# EAGLE schematic MSboard (EAGLE 7.2.0)
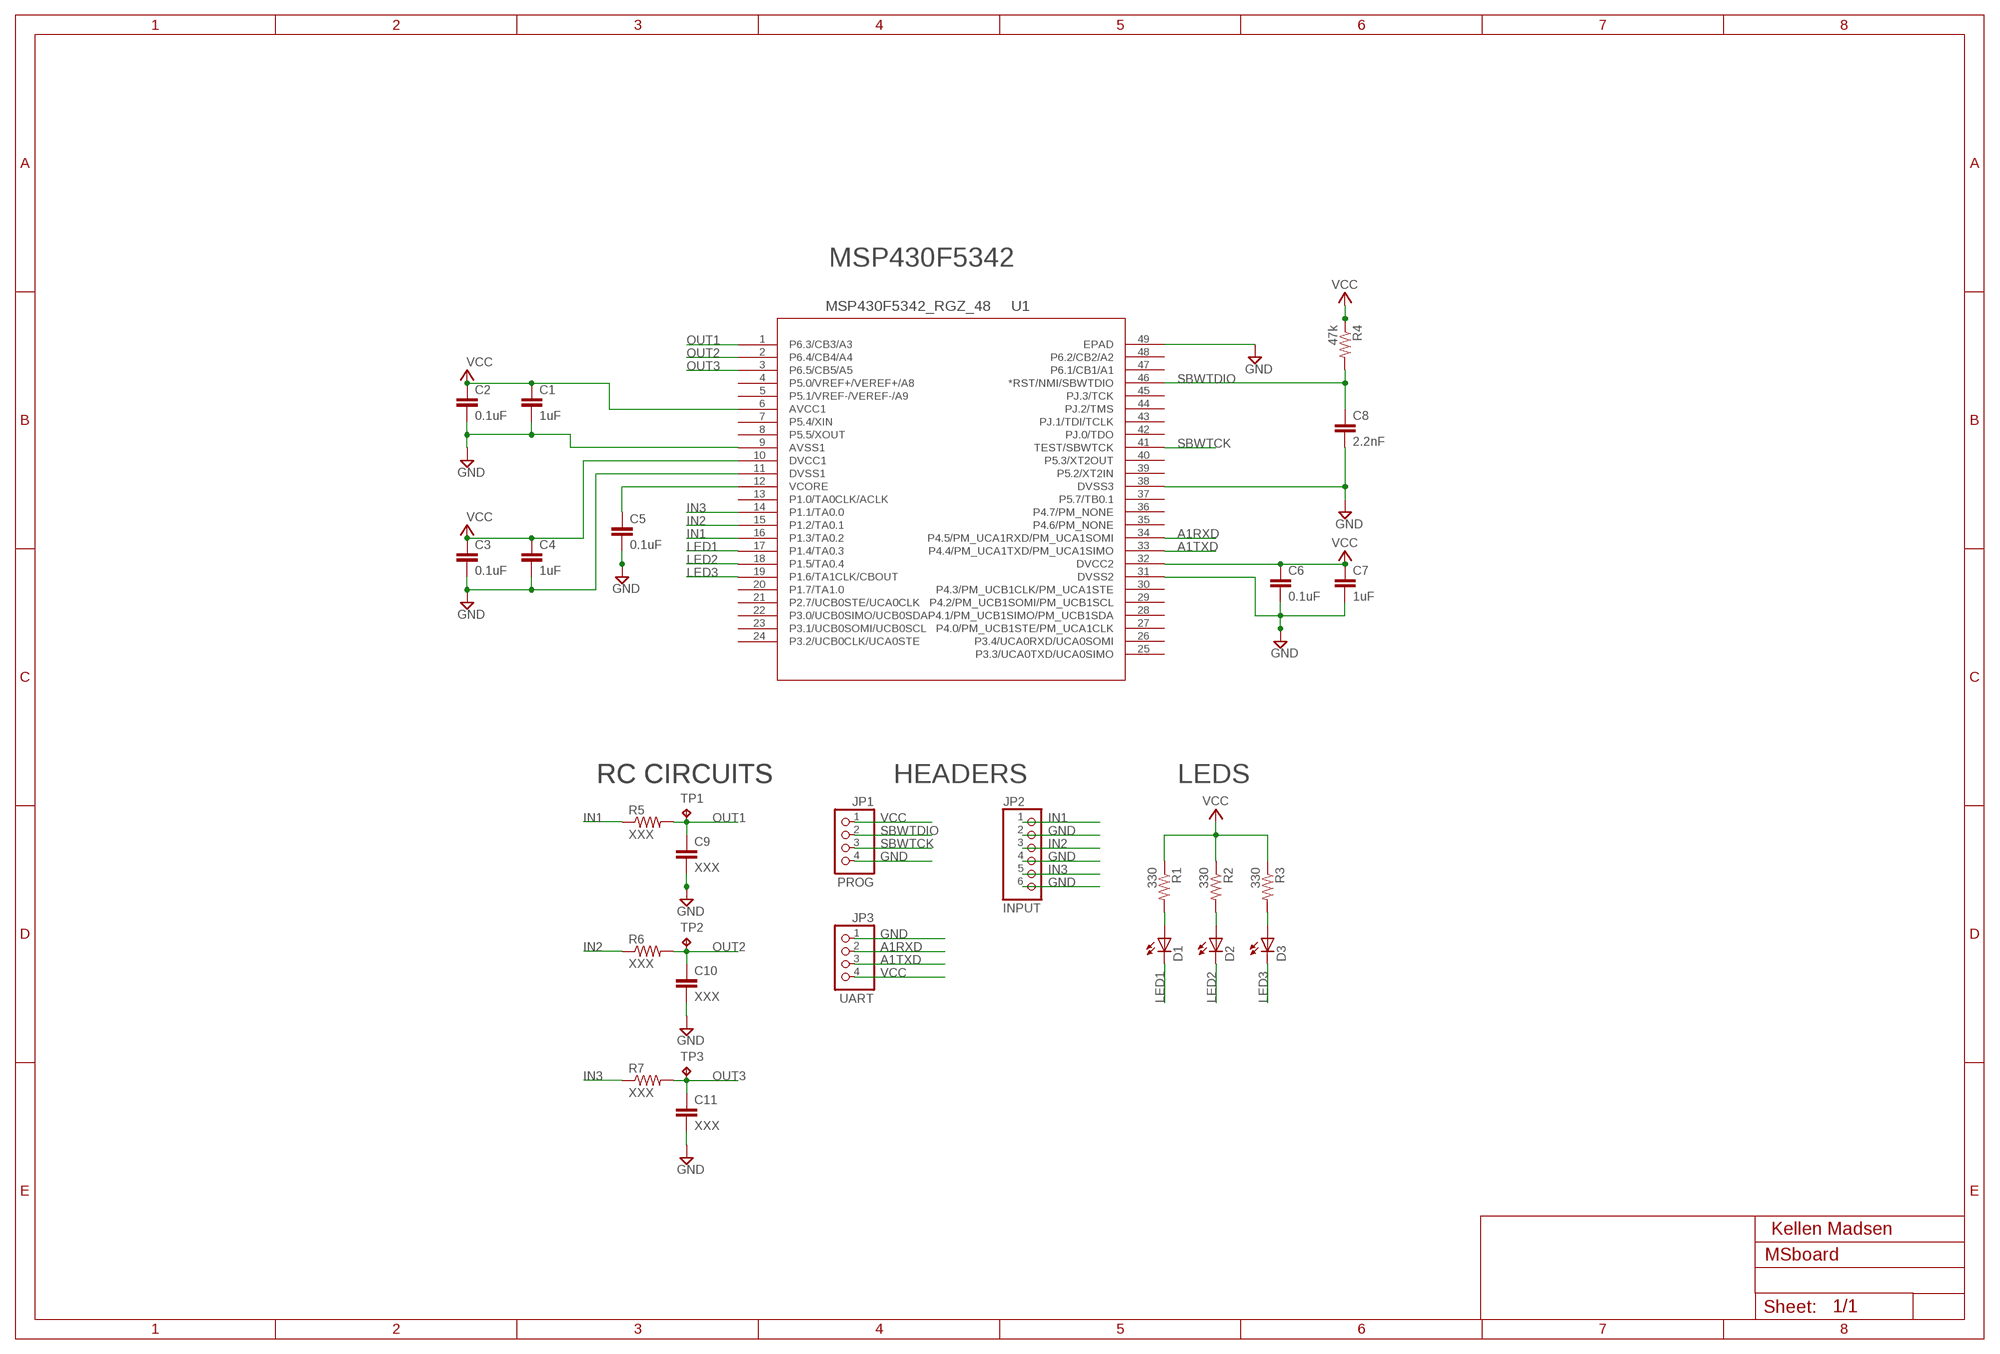
[diagram p0: schematic, sheet 1]

## Parts
C1  1uF  C-EUC0603  [C0603]
C2  0.1uF  C-EUC0603  [C0603]
C3  0.1uF  C-EUC0603  [C0603]
C4  1uF  C-EUC0603  [C0603]
C5  0.1uF  C-EUC0603  [C0603]
C6  0.1uF  C-EUC0603  [C0603]
C7  1uF  C-EUC0603  [C0603]
C8  2.2nF  C-EUC0603  [C0603]
C9  XXX  C-EUC0603  [C0603]
C10  XXX  C-EUC0603  [C0603]
C11  XXX  C-EUC0603  [C0603]
D1  LEDCHIPLED_0603  [CHIPLED_0603]
D2  LEDCHIPLED_0603  [CHIPLED_0603]
D3  LEDCHIPLED_0603  [CHIPLED_0603]
JP1  PROG  PINHD-1X4  [1X04]
JP2  INPUT  PINHD-1X6  [1X06]
JP3  UART  PINHD-1X4  [1X04]
R1  330  R-US_R0603  [R0603]
R2  330  R-US_R0603  [R0603]
R3  330  R-US_R0603  [R0603]
R4  47k  R-US_R0603  [R0603]
R5  XXX  R-US_R0603  [R0603]
R6  XXX  R-US_R0603  [R0603]
R7  XXX  R-US_R0603  [R0603]
TP1  TPPAD1-13Y  [P1-13Y]
TP2  TPPAD1-13Y  [P1-13Y]
TP3  TPPAD1-13Y  [P1-13Y]
U1  MSP430F5342_RGZ_48  [RGZ48_5P15X5P15]

## Nets
A1RXD: JP3.2 U1.34(P4.5/PM_UCA1RXD/PM_UCA1SOMI)
A1TXD: JP3.3 U1.33(P4.4/PM_UCA1TXD/PM_UCA1SIMO)
GND: C1.2 C2.2 C3.2 C4.2 C5.2 C6.2 C7.2 C8.2 C9.2 C10.2 C11.2 JP1.4 JP2.2 JP2.4 JP2.6 JP3.1 U1.9(AVSS1) U1.11(DVSS1) U1.31(DVSS2) U1.38(DVSS3) U1.49(EPAD)
IN1: JP2.1 R5.1 U1.16(P1.3/TA0.2)
IN2: JP2.3 R6.1 U1.15(P1.2/TA0.1)
IN3: JP2.5 R7.1 U1.14(P1.1/TA0.0)
LED1: D1.C U1.17(P1.4/TA0.3)
LED2: D2.C U1.18(P1.5/TA0.4)
LED3: D3.C U1.19(P1.6/TA1CLK/CBOUT)
N$4: D1.A R1.2
N$5: D2.A R2.2
N$6: D3.A R3.2
OUT1: C9.1 R5.2 TP1.TP U1.1(P6.3/CB3/A3)
OUT2: C10.1 R6.2 TP2.TP U1.2(P6.4/CB4/A4)
OUT3: C11.1 R7.2 TP3.TP U1.3(P6.5/CB5/A5)
SBWTCK: JP1.3 U1.41(TEST/SBWTCK)
SBWTDIO: C8.1 JP1.2 R4.2 U1.46(*RST/NMI/SBWTDIO)
VCC: C1.1 C2.1 C3.1 C4.1 C6.1 C7.1 JP1.1 JP3.4 R1.1 R2.1 R3.1 R4.1 U1.6(AVCC1) U1.10(DVCC1) U1.32(DVCC2)
VCORE: C5.1 U1.12(VCORE)
Unconnected: U1.4(P5.0/VREF+/VEREF+/A8) U1.5(P5.1/VREF-/VEREF-/A9) U1.7(P5.4/XIN) U1.8(P5.5/XOUT) U1.13(P1.0/TA0CLK/ACLK) U1.20(P1.7/TA1.0) U1.21(P2.7/UCB0STE/UCA0CLK) U1.22(P3.0/UCB0SIMO/UCB0SDA) U1.23(P3.1/UCB0SOMI/UCB0SCL) U1.24(P3.2/UCB0CLK/UCA0STE) U1.25(P3.3/UCA0TXD/UCA0SIMO) U1.26(P3.4/UCA0RXD/UCA0SOMI) U1.27(P4.0/PM_UCB1STE/PM_UCA1CLK) U1.28(P4.1/PM_UCB1SIMO/PM_UCB1SDA) U1.29(P4.2/PM_UCB1SOMI/PM_UCB1SCL) U1.30(P4.3/PM_UCB1CLK/PM_UCA1STE) U1.35(P4.6/PM_NONE) U1.36(P4.7/PM_NONE) U1.37(P5.7/TB0.1) U1.39(P5.2/XT2IN) U1.40(P5.3/XT2OUT) U1.42(PJ.0/TDO) U1.43(PJ.1/TDI/TCLK) U1.44(PJ.2/TMS) U1.45(PJ.3/TCK) U1.47(P6.1/CB1/A1) U1.48(P6.2/CB2/A2)

## Notes on the sheet
- MSP430F5342
- RC CIRCUITS | RC CIRCUITS | HEADERS | LEDS
- Kellen Madsen

## Library data of the parts
C1-C11 = resistor:C-EU: CAPACITOR, European symbol
D1-D3 = led:LED: LED OSRAM: - CHIPLED LG R971, LG N971, LY N971, LG Q971, LY Q971, LO R971, LY R971 LH N974, LH R974 LS Q976, LO Q976, LY Q976 LO Q996 - Hyper CHIPLED LW Q18S LB Q993, LB Q99A, LB R99A - SideLED LS A670, LO A670, LY A670, LG A670, LP A670 LB A673, LV A673, LT A673, LW A673 LH A674 LY A675 LS A676, LA A676, LO A676, LY A676, LW A676 LS A679, LY A679, LG A679 - Hyper Micro SIDELED® LS Y876, LA Y876, LO Y876, LY Y876 LT Y87S - SmartLED LW L88C, LW L88S LB L89C, LB L89S, LG L890 LS L89K, LO L89K, LY L89K LS L896, LA L896, LO L896, LY L896 - TOPLED LS T670, LO T670, LY T670, LG T670, LP T670 LSG T670, LSP T670, LSY T670, LOP T670, LYG T670 LG T671, LOG T671, LSG T671 LB T673, LV T673, LT T673, LW T673 LH T674 LS T676, LA T676, LO T676, LY T676, LB T676, LH T676, LSB T676, LW T676 LB T67C, LV T67C, LT T67C, LS T67K, LO T67K, LY T67K, LW E67C LS E67B, LA E67B, LO E67B, LY E67B, LB E67C, LV E67C, LT E67C LW T67C LS T679, LY T679, LG T679 LS T770, LO T770, LY T770, LG T770, LP T770 LB T773, LV T773, LT T773, LW T773 LH T774 LS E675, LA E675, LY E675, LS T675 LS T776, LA T776, LO T776, LY T776, LB T776 LHGB T686 LT T68C, LB T68C - Hyper Mini TOPLED® LB M676 - Mini TOPLED Santana® LG M470 LS M47K, LO M47K, LY M47K Source: http://www.osram.convergy.de LUXEON: - LUMILED® LXK2-PW12-R00, LXK2-PW12-S00, LXK2-PW14-U00, LXK2-PW14-V00 LXK2-PM12-R00, LXK2-PM12-S00, LXK2-PM14-U00 LXK2-PE12-Q00, LXK2-PE12-R00, LXK2-PE12-S00, LXK2-PE14-T00, LXK2-PE14-U00 LXK2-PB12-K00, LXK2-PB12-L00, LXK2-PB12-M00, LXK2-PB14-N00, LXK2-PB14-P00, LXK2-PB14-Q00 LXK2-PR12-L00, LXK2-PR12-M00, LXK2-PR14-Q00, LXK2-PR14-R00 LXK2-PD12-Q00, LXK2-PD12-R00, LXK2-PD12-S00 LXK2-PH12-R00, LXK2-PH12-S00 LXK2-PL12-P00, LXK2-PL12-Q00, LXK2-PL12-R00 Source: www.luxeon.com KINGBRIGHT: KA-3528ASYC Source: www.kingbright.com
JP1 JP3 = pinhead:PINHD-1X4: PIN HEADER
JP2 = pinhead:PINHD-1X6: PIN HEADER
R1-R7 = resistor:R-US_: RESISTOR, American symbol
TP1-TP3 = testpad:TP: Test pad
U1 = msp430f5342:MSP430F5342_RGZ_48; DATASHEETURL: http://www.ti.com/lit/gpn/MSP430F5342; DESCRIPTION: MSP430F534x Mixed Signal Microcontroller; FAMILY_NAME: 5 Series; GENERIC_PART_NUMBER: MSP430F5342; INDUSTRY_STD_PKG_TYPE: VQFN; MANUFACTURER: Texas Instruments; MANUFACTURER_PART_NUMBER: msp430f5342_rgz_48; PACKAGE_DESIGNATOR: RGZ; PIN_COUNT: 48; VENDOR: Texas Instruments

## Net classes
0 default: width 0.3 mm, drill 0.6 mm, clearance 0.2 mm
1 power: width 0.4 mm, drill 0.6 mm, clearance 0.2 mm